# Altium schematic sheet Sheet1.SchDoc: Alyssa's Night Light
size A4; Author: Judd Foster; DrawnBy: Judd Foster; Engineer: Judd Foster; Organization: Altium Limited; Address1: L3, 12a Rodborough Rd; Address2: Frenchs Forest; Address3: NSW; Address4: Australia 2086; Revision: B; SheetNumber: 1; SheetTotal: 1
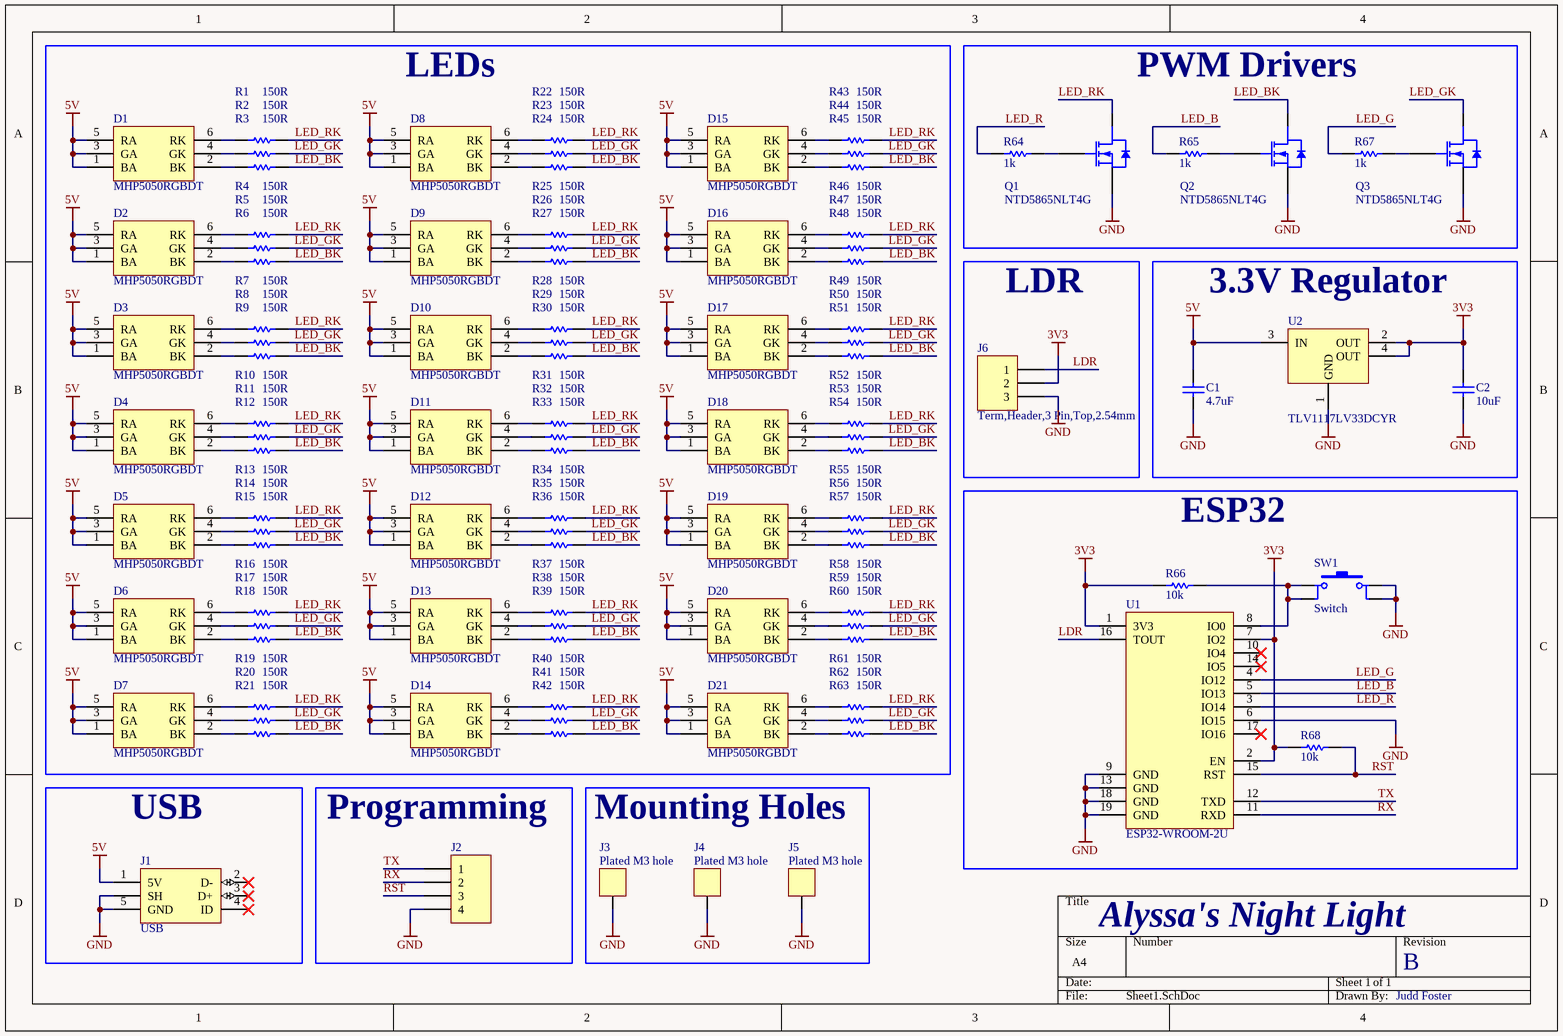
[diagram p0: Sheet1.SchDoc]

## Parts
C1  4.7uF  [Cap,SMD,0805]
C2  10uF  [Cap,SMD,0805]
D1  MHP5050RGBDT  [LED,RGB,SMD,5050]
D2  MHP5050RGBDT  [LED,RGB,SMD,5050]
D3  MHP5050RGBDT  [LED,RGB,SMD,5050]
D4  MHP5050RGBDT  [LED,RGB,SMD,5050]
D5  MHP5050RGBDT  [LED,RGB,SMD,5050]
D6  MHP5050RGBDT  [LED,RGB,SMD,5050]
D7  MHP5050RGBDT  [LED,RGB,SMD,5050]
D8  MHP5050RGBDT  [LED,RGB,SMD,5050]
D9  MHP5050RGBDT  [LED,RGB,SMD,5050]
D10  MHP5050RGBDT  [LED,RGB,SMD,5050]
D11  MHP5050RGBDT  [LED,RGB,SMD,5050]
D12  MHP5050RGBDT  [LED,RGB,SMD,5050]
D13  MHP5050RGBDT  [LED,RGB,SMD,5050]
D14  MHP5050RGBDT  [LED,RGB,SMD,5050]
D15  MHP5050RGBDT  [LED,RGB,SMD,5050]
D16  MHP5050RGBDT  [LED,RGB,SMD,5050]
D17  MHP5050RGBDT  [LED,RGB,SMD,5050]
D18  MHP5050RGBDT  [LED,RGB,SMD,5050]
D19  MHP5050RGBDT  [LED,RGB,SMD,5050]
D20  MHP5050RGBDT  [LED,RGB,SMD,5050]
D21  MHP5050RGBDT  [LED,RGB,SMD,5050]
J1  USB  [Conn,USB,MicroB,SMD]
J2  Term,Header,4 Pin,Top,2.54mm  [Term,Header,4Pin,2.54mm]  (value not drawn)
J3  Plated M3 hole  [HOLE,M3,3mm,PLATED]
J4  Plated M3 hole  [HOLE,M3,3mm,PLATED]
J5  Plated M3 hole  [HOLE,M3,3mm,PLATED]
J6  Term,Header,3 Pin,Top,2.54mm  [Term,Header,3Pin,2.54mm]
Q1  NTD5865NLT4G  [DPAK3 (TO-252 3 Lead)]
Q2  NTD5865NLT4G  [DPAK3 (TO-252 3 Lead)]
Q3  NTD5865NLT4G  [DPAK3 (TO-252 3 Lead)]
R1  150R  [RES,0603]
R2  150R  [RES,0603]
R3  150R  [RES,0603]
R4  150R  [RES,0603]
R5  150R  [RES,0603]
R6  150R  [RES,0603]
R7  150R  [RES,0603]
R8  150R  [RES,0603]
R9  150R  [RES,0603]
R10  150R  [RES,0603]
R11  150R  [RES,0603]
R12  150R  [RES,0603]
R13  150R  [RES,0603]
R14  150R  [RES,0603]
R15  150R  [RES,0603]
R16  150R  [RES,0603]
R17  150R  [RES,0603]
R18  150R  [RES,0603]
R19  150R  [RES,0603]
R20  150R  [RES,0603]
R21  150R  [RES,0603]
R22  150R  [RES,0603]
R23  150R  [RES,0603]
R24  150R  [RES,0603]
R25  150R  [RES,0603]
R26  150R  [RES,0603]
R27  150R  [RES,0603]
R28  150R  [RES,0603]
R29  150R  [RES,0603]
R30  150R  [RES,0603]
R31  150R  [RES,0603]
R32  150R  [RES,0603]
R33  150R  [RES,0603]
R34  150R  [RES,0603]
R35  150R  [RES,0603]
R36  150R  [RES,0603]
R37  150R  [RES,0603]
R38  150R  [RES,0603]
R39  150R  [RES,0603]
R40  150R  [RES,0603]
R41  150R  [RES,0603]
R42  150R  [RES,0603]
R43  150R  [RES,0603]
R44  150R  [RES,0603]
R45  150R  [RES,0603]
R46  150R  [RES,0603]
R47  150R  [RES,0603]
R48  150R  [RES,0603]
R49  150R  [RES,0603]
R50  150R  [RES,0603]
R51  150R  [RES,0603]
R52  150R  [RES,0603]
R53  150R  [RES,0603]
R54  150R  [RES,0603]
R55  150R  [RES,0603]
R56  150R  [RES,0603]
R57  150R  [RES,0603]
R58  150R  [RES,0603]
R59  150R  [RES,0603]
R60  150R  [RES,0603]
R61  150R  [RES,0603]
R62  150R  [RES,0603]
R63  150R  [RES,0603]
R64  1k  [RES,0603]
R65  1k  [RES,0603]
R66  10k  [RES,0603]
R67  1k  [RES,0603]
R68  10k  [RES,0603]
SW1  Switch  [Switch,Tactile,SPST-NO,SMD]
U1  ESP32-WROOM-2U  [ESP32-WROOM-02U]
U2  TLV1117LV33DCYR  [SOT223]

## Blocks framed on the sheet
LEDs: D1-D21 R1-R63
PWM Drivers: Q1-Q3 R64 R65 R67
LDR: J6
3.3V Regulator: C1 C2 U2
ESP32: R66 R68 SW1 U1
USB: J1
Programming: J2
Mounting Holes: J3-J5

## Nets
3V3: C2.2 J6.2 R66.2 R68.1 U1.1(3V3) U1.2(EN) U1.7(IO2) U2.2(OUT) U2.4(OUT)
5V: C1.2 D1.1(BA) D1.3(GA) D1.5(RA) D2.1(BA) D2.3(GA) D2.5(RA) D3.1(BA) D3.3(GA) D3.5(RA) D4.1(BA) D4.3(GA) D4.5(RA) D5.1(BA) D5.3(GA) D5.5(RA) D6.1(BA) D6.3(GA) D6.5(RA) D7.1(BA) D7.3(GA) D7.5(RA) D8.1(BA) D8.3(GA) D8.5(RA) D9.1(BA) D9.3(GA) D9.5(RA) D10.1(BA) D10.3(GA) D10.5(RA) D11.1(BA) D11.3(GA) D11.5(RA) D12.1(BA) D12.3(GA) D12.5(RA) D13.1(BA) D13.3(GA) D13.5(RA) D14.1(BA) D14.3(GA) D14.5(RA) D15.1(BA) D15.3(GA) D15.5(RA) D16.1(BA) D16.3(GA) D16.5(RA) D17.1(BA) D17.3(GA) D17.5(RA) D18.1(BA) D18.3(GA) D18.5(RA) D19.1(BA) D19.3(GA) D19.5(RA) D20.1(BA) D20.3(GA) D20.5(RA) D21.1(BA) D21.3(GA) D21.5(RA) J1.1(5V) U2.3(IN)
GND: C1.1 C2.1 J1.0(SH) J1.5(GND) J2.4 J3.0(PIN) J4.0(PIN) J5.0(PIN) J6.3 Q1.3(S) Q2.3(S) Q3.3(S) SW1.3 SW1.4 U1.6(IO15) U1.9(GND) U1.13(GND) U1.18(GND) U1.19(GND) U2.1(GND)
LDR: J6.1 U1.16(TOUT)
LED_B: R65.1 U1.5(IO13)
LED_BK: Q2.4(D) R3.2 R6.2 R9.2 R12.2 R15.2 R18.2 R21.2 R24.2 R27.2 R30.2 R33.2 R36.2 R39.2 R42.2 R45.2 R48.2 R51.2 R54.2 R57.2 R60.2 R63.2
LED_G: R67.1 U1.4(IO12)
LED_GK: Q3.4(D) R2.2 R5.2 R8.2 R11.2 R14.2 R17.2 R20.2 R23.2 R26.2 R29.2 R32.2 R35.2 R38.2 R41.2 R44.2 R47.2 R50.2 R53.2 R56.2 R59.2 R62.2
LED_R: R64.1 U1.3(IO14)
LED_RK: Q1.4(D) R1.2 R4.2 R7.2 R10.2 R13.2 R16.2 R19.2 R22.2 R25.2 R28.2 R31.2 R34.2 R37.2 R40.2 R43.2 R46.2 R49.2 R52.2 R55.2 R58.2 R61.2
RST: J2.3 R68.2 U1.15(RST)
RX: J2.2 U1.11(RXD)
TX: J2.1 U1.12(TXD)
NetD1_2: D1.2(BK) R3.1
NetD1_4: D1.4(GK) R2.1
NetD1_6: D1.6(RK) R1.1
NetD2_2: D2.2(BK) R6.1
NetD2_4: D2.4(GK) R5.1
NetD2_6: D2.6(RK) R4.1
NetD3_2: D3.2(BK) R9.1
NetD3_4: D3.4(GK) R8.1
NetD3_6: D3.6(RK) R7.1
NetD4_2: D4.2(BK) R12.1
NetD4_4: D4.4(GK) R11.1
NetD4_6: D4.6(RK) R10.1
NetD5_2: D5.2(BK) R15.1
NetD5_4: D5.4(GK) R14.1
NetD5_6: D5.6(RK) R13.1
NetD6_2: D6.2(BK) R18.1
NetD6_4: D6.4(GK) R17.1
NetD6_6: D6.6(RK) R16.1
NetD7_2: D7.2(BK) R21.1
NetD7_4: D7.4(GK) R20.1
NetD7_6: D7.6(RK) R19.1
NetD8_2: D8.2(BK) R24.1
NetD8_4: D8.4(GK) R23.1
NetD8_6: D8.6(RK) R22.1
NetD9_2: D9.2(BK) R27.1
NetD9_4: D9.4(GK) R26.1
NetD9_6: D9.6(RK) R25.1
NetD10_2: D10.2(BK) R30.1
NetD10_4: D10.4(GK) R29.1
NetD10_6: D10.6(RK) R28.1
NetD11_2: D11.2(BK) R33.1
NetD11_4: D11.4(GK) R32.1
NetD11_6: D11.6(RK) R31.1
NetD12_2: D12.2(BK) R36.1
NetD12_4: D12.4(GK) R35.1
NetD12_6: D12.6(RK) R34.1
NetD13_2: D13.2(BK) R39.1
NetD13_4: D13.4(GK) R38.1
NetD13_6: D13.6(RK) R37.1
NetD14_2: D14.2(BK) R42.1
NetD14_4: D14.4(GK) R41.1
NetD14_6: D14.6(RK) R40.1
NetD15_2: D15.2(BK) R45.1
NetD15_4: D15.4(GK) R44.1
NetD15_6: D15.6(RK) R43.1
NetD16_2: D16.2(BK) R48.1
NetD16_4: D16.4(GK) R47.1
NetD16_6: D16.6(RK) R46.1
NetD17_2: D17.2(BK) R51.1
NetD17_4: D17.4(GK) R50.1
NetD17_6: D17.6(RK) R49.1
NetD18_2: D18.2(BK) R54.1
NetD18_4: D18.4(GK) R53.1
NetD18_6: D18.6(RK) R52.1
NetD19_2: D19.2(BK) R57.1
NetD19_4: D19.4(GK) R56.1
NetD19_6: D19.6(RK) R55.1
NetD20_2: D20.2(BK) R60.1
NetD20_4: D20.4(GK) R59.1
NetD20_6: D20.6(RK) R58.1
NetD21_2: D21.2(BK) R63.1
NetD21_4: D21.4(GK) R62.1
NetD21_6: D21.6(RK) R61.1
NetQ1_1: Q1.1(G) R64.2
NetQ2_1: Q2.1(G) R65.2
NetQ3_1: Q3.1(G) R67.2
NetR66_1: R66.1 SW1.1 SW1.2 U1.8(IO0)

Not connected (* = marked no-connect by the designer): J1 2(D-)* 3(D+)* 4(ID)*; U1 10(IO4)* 14(IO5)* 17(IO16)*

## Notes on the sheet
- Title
- Size:
- Date:
- A3
- Revision:
- Sheet
- of
- Design By:

## Library data of the parts
C1 = CAP,Cer,4.7uF,16VDC,X7R,0805: 4.7µF ±10% 16V Ceramic Capacitor X7R 0805 (2012 Metric); Vendor Part Number: 490-14466-1-ND; Manufacturer: KEMET; Manufacturer Part Number: GRM21BR71C475KE51L; Vendor: Digikey; HelpURL: https://search.murata.co.jp/Ceramy/image/img/A01X/G101/ENG/GRM21BR71C475KE51-01.pdf; CreatedBy: Judd Foster
C2 = CAP,Cer,10uF,10VDC,X5R,0805: CAP CER 10UF 10V X5R 0805; Vendor Part Number: 399-4925-1-ND; Manufacturer: KEMET; Manufacturer Part Number: C0805C106K8PACTU; Vendor: Digikey; HelpURL: https://content.kemet.com/datasheets/KEM_C1006_X5R_SMD.pdf; CreatedBy: Judd Foster
D1-D21 = LED,Tri-Color,RGB,SMD,5050: SMD,5x5mm Light Emitting Diodes (LED) RoHS; Manufacturer: MEIHUA; Vendor Part Number: C409780; Vendor: LCSC; CreatedBy: Judd Foster; HelpURL: https://datasheet.lcsc.com/szlcsc/1912111437_MEIHUA-MHP5050RGBDT_C409780.pdf; Manufacturer Part Number: MHP5050RGBDT
J1 = Conn,USB.Micro_B,SMD: USB - micro B USB 2.0 Receptacle Connector 5 Position Surface Mount, Right Angle; Through Hole; Manufacturer: Amphenol ICC (FCI); Manufacturer Part Number: 10118193-0001LF; Vendor Part Number: 609-4616-1-ND; Vendor: Digikey; CreatedBy: Judd Foster; HelpURL: https://cdn.amphenol-icc.com/media/wysiwyg/files/documentation/datasheet/inputoutput/io_usb_micro.pdf
J2 = Term,Header,4 Pin,Top,2.54mm: Connector Header Through Hole 4 position 0.100" (2.54mm); Vendor Part Number: 609-10082627-404HLF-ND; Manufacturer: Amphenol ICC (FCI); Manufacturer Part Number: 10082627-404HLF; Vendor: Digikey; HelpURL: https://cdn.amphenol-icc.com/media/wysiwyg/files/drawing/10082627.pdf; Created By: Judd Foster
J3-J5 = Mech,Hole,M3,3mm,Plated: 3.5mm Drill, 7.4mm Pad, PTH; CreatedBy: Judd Foster; HelpURL: N/A; Manufacturer: N/A; Manufacturer Part Number: N/A; Vendor: N/A; Vendor Part Number: N/A
J6 = Term,Header,3 Pin,Top,2.54mm: CONN HEADER VERT 3POS 2.54MM; Vendor Part Number: 732-5316-ND; Manufacturer: Würth Elektronik; Manufacturer Part Number: 61300311121; Vendor: Digikey; HelpURL: https://katalog.we-online.de/em/datasheet/6130xx11121.pdf; Created By: Judd Foster
Q1-Q3 = MOSFET,N Ch,60V,46A: MOSFET N-CH 60V 46A DPAK; Manufacturer: ON Semiconductor; Vendor Part Number: NTD5865NLT4GOSCT-ND; Vendor: Digikey; CreatedBy: Judd Foster; HelpURL: https://www.onsemi.com/pub/Collateral/NTD5865NL-D.PDF; Manufacturer Part Number: NTD5865NLT4G
R1-R63 = RES,150R,1%,0.1W,0603: 150 Ohms ±1% 0.1W, 1/10W Chip Resistor 0603 (1608 Metric) Automotive AEC-Q200, Moisture Resistant Thick Film; Manufacturer: TE Connectivity Passive Product; Manufacturer Part Number: CRGCQ0603F150R; Vendor Part Number: A129678CT-ND; Vendor: Digikey; CreatedBy: Judd Foster; HelpURL: https://www.te.com/commerce/DocumentDelivery/DDEController?Action=srchrtrv&DocNm=1773204-3&DocType=DS&DocLang=English
R64 R65 R67 = RES,1k,1%,0.1W,0603: RES SMD 1K OHM 1% 1/10W 0603; Manufacturer: Yageo; Manufacturer Part Number: RC0603FR-071KL; Vendor Part Number: 311-1.00KHRCT-ND; Vendor: Digikey; CreatedBy: Judd Foster; HelpURL: https://www.yageo.com/upload/media/product/productsearch/datasheet/rchip/PYu-RC_Group_51_RoHS_L_10.pdf
R66 R68 = RES,10k,1%,0.1W,0603: RES SMD 10K OHM 1% 1/10W 0603; Manufacturer: Yageo; Manufacturer Part Number: RC0603FR-0710KL; Vendor Part Number: 311-10.0KHRCT-ND; Vendor: Digikey; CreatedBy: Judd Foster; HelpURL: https://www.yageo.com/upload/media/product/productsearch/datasheet/rchip/PYu-RC_Group_51_RoHS_L_10.pdf
SW1 = Switch,Tactile,SPST-NO,SMD,H4.3: Tactile Switch SPST-NO Top Actuated Surface Mount; Manufacturer: C&K; Manufacturer Part Number: PTS645SK43SMTR92 LFS; Vendor Part Number: CKN9084CT-ND; Vendor: Digikey; CreatedBy: Judd Foster; HelpURL: https://dznh3ojzb2azq.cloudfront.net/products/Tactile/PTS645/documents/datasheet.pdf
U1 = ESP32-WROOM-2U: WiFi 802.11b/g/n Transceiver Module 2.4GHz ~ 2.5GHz Integrated, Chip + IPEX Surface Mount; Manufacturer: Espressif Systems; Manufacturer Part Number: ESP-WROOM-02U (4MB); Vendor Part Number: 1965-ESP-WROOM-02U(4MB)CT-ND; Vendor: Digikey; CreatedBy: Judd Foster; HelpURL: https://www.espressif.com/sites/default/files/documentation/esp-wroom-02u_esp-wroom-02d_datasheet_en.pdf
U2 = TLV1117LV33DCYR: Linear Voltage Regulator IC  1 Output  1A SOT-223-4; Manufacturer: Texas Instruments; Vendor Part Number: 296-28778-1-ND; Vendor: Digikey; CreatedBy: Judd Foster; HelpURL: http://www.ti.com/lit/ds/symlink/tlv1117lv.pdf; Manufacturer Part Number: TLV1117LV33DCYR